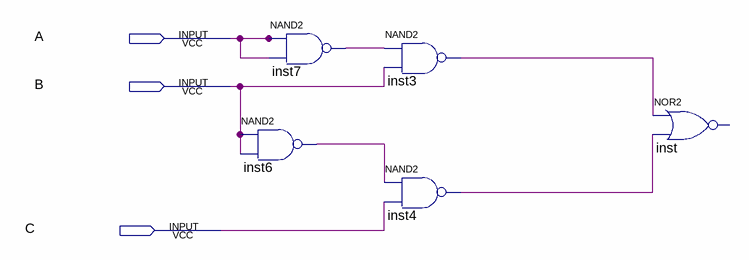
[diagram p0: schematic sheet]
// Quartus schematic Prelab1.bdf as structural Verilog: 5 symbols, 3 pins
module Prelab1 (
  input  A,
  input  B,
  input  C
);

  wire inst3_out, inst4_out, inst6_out, inst7_out;

  nand inst7 (inst7_out, A, A);
  nand inst6 (inst6_out, B, B);
  nand inst3 (inst3_out, inst7_out, B);
  nand inst4 (inst4_out, inst6_out, C);
  // NOR2 inst has open pins: IN1=inst3_out, IN2=inst4_out, OUT=open
endmodule
